# Altium schematic sheet 主控制器.SchDoc
size A3; Organization: Altium Limited; Address1: L3, 12a Rodborough Rd; Address2: Frenchs Forest; Address3: NSW; Address4: Australia 2086
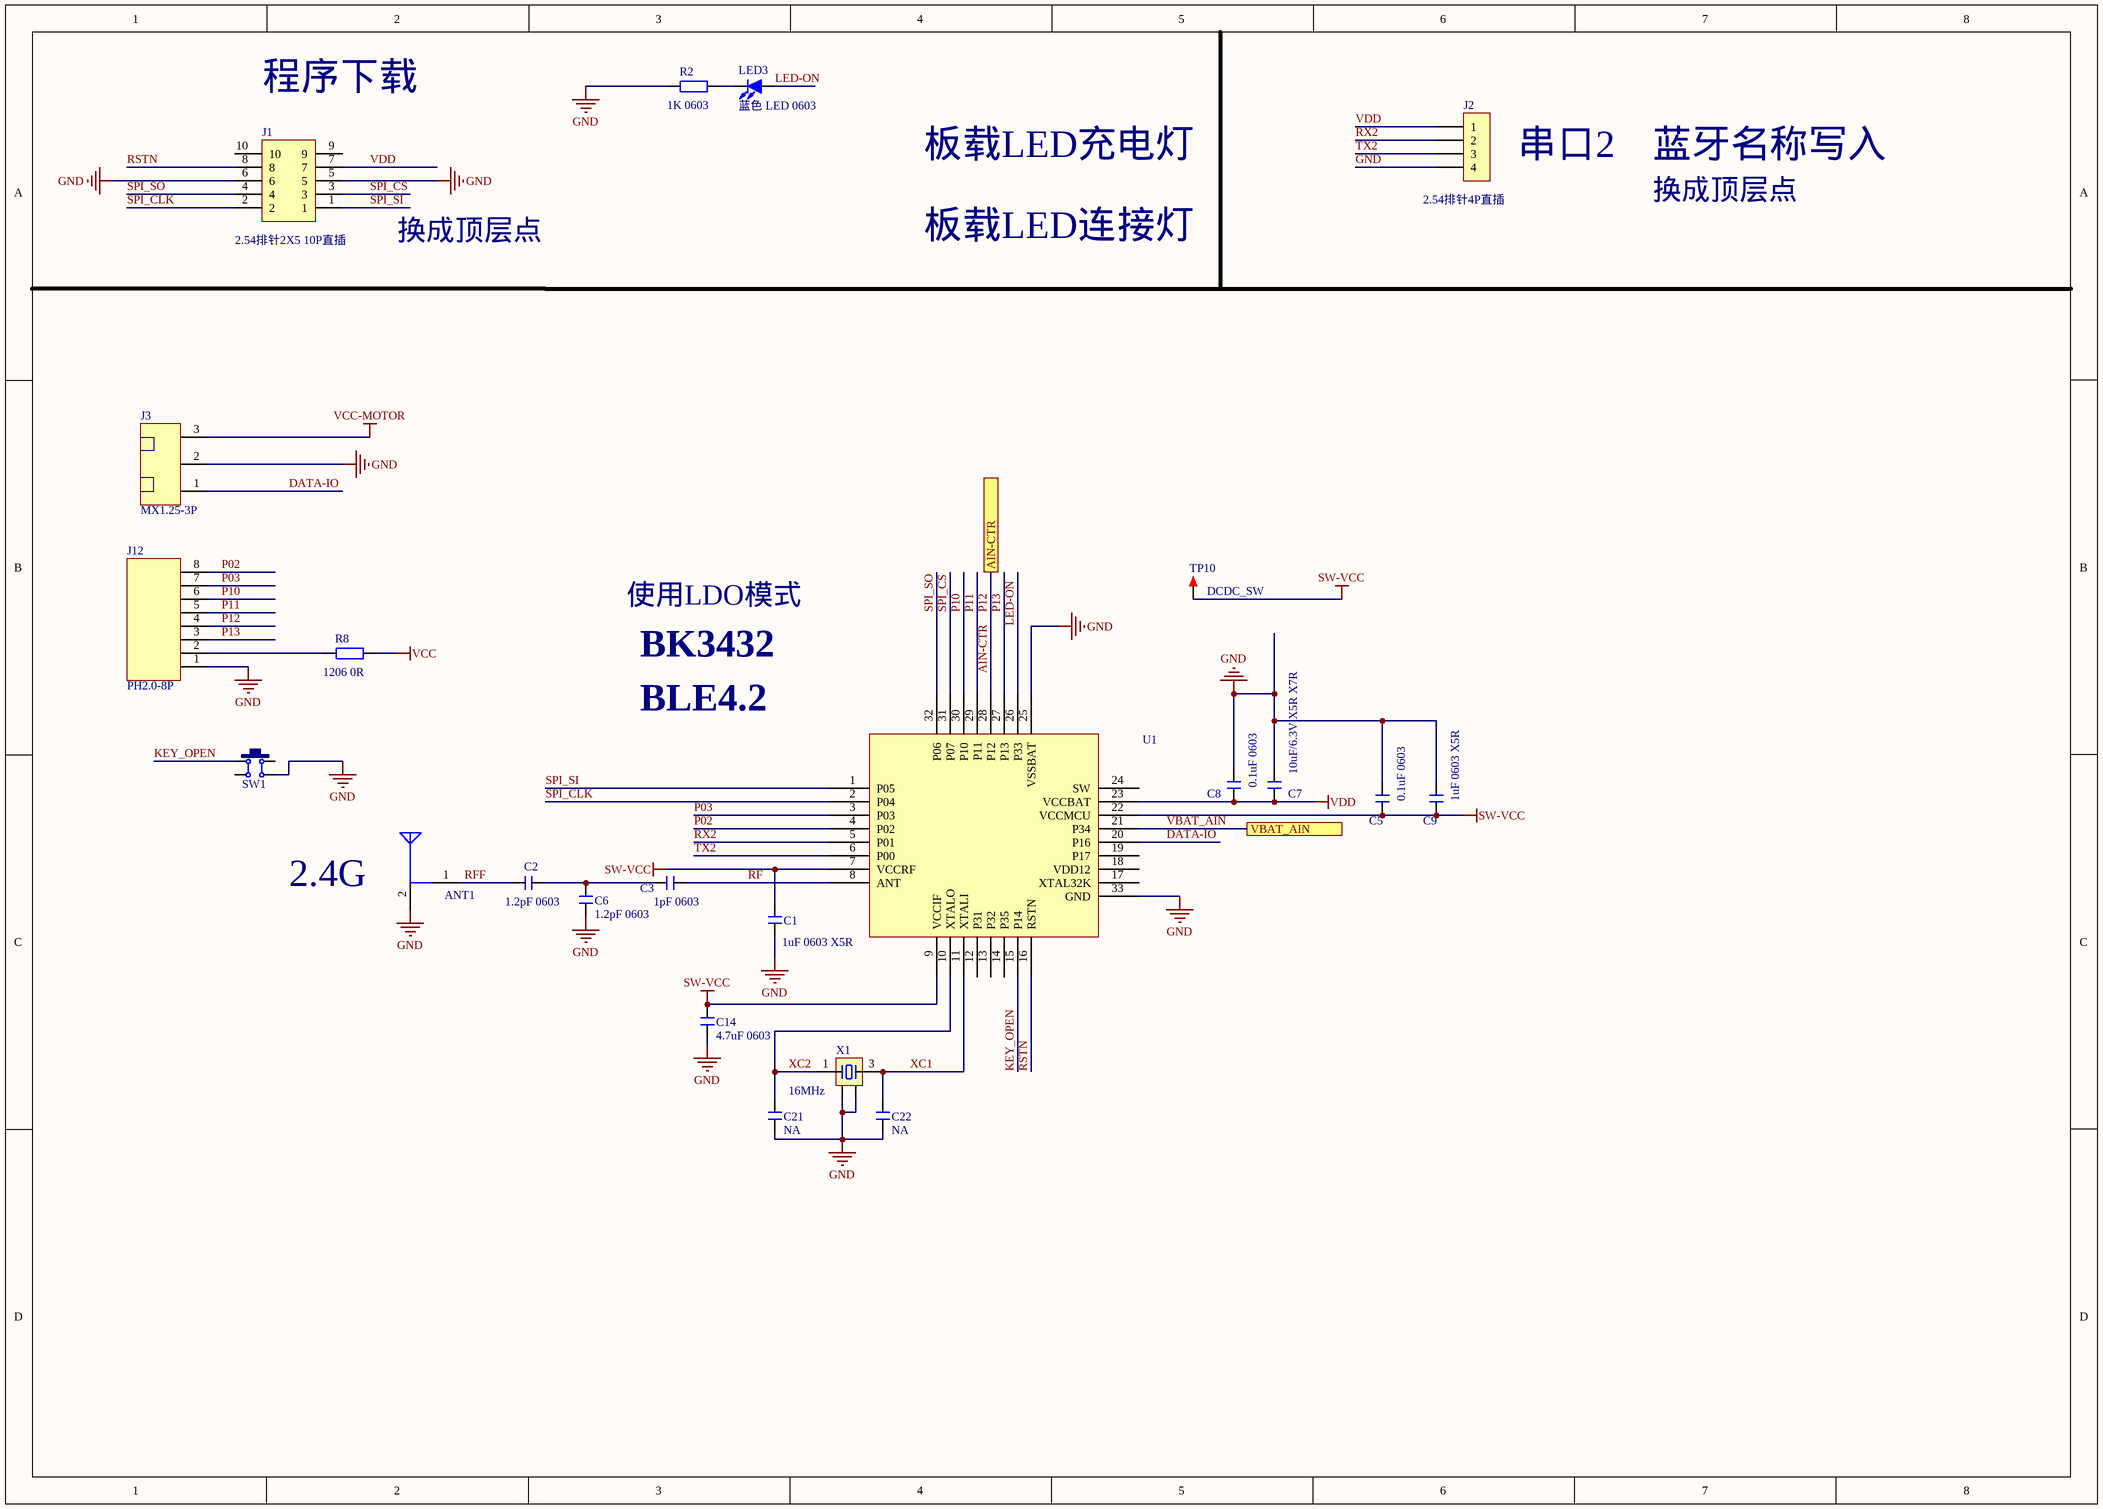
[diagram p0: 主控制器.SchDoc]

## Parts
ANT1  Board_RF  [BK3432-RF-2]  (value not drawn)
C1  1uF 0603 X5R  [C 0603]
C2  1.2pF 0603  [C 0603]
C3  1pF 0603  [C 0603]
C5  0.1uF 0603  [C 0603]
C6  1.2pF 0603  [C 0603]
C7  10uF/6.3V X5R X7R  [C 0603]
C8  0.1uF 0603  [C 0603]
C9  1uF 0603 X5R  [C 0603]
C14  4.7uF 0603  [C 0603]
C21  NA  [C 0603]
C22  NA  [C 0603]
J1  2.54排针2X5 10P直插  [Pin HDR2X5/2.54mm]
J2  2.54排针4P直插  [Pin HDR2.54MM/1X4]
J3  MX1.25-3P  [MX1.25S-3P]
J12  PH2.0-8P  [PH2.0-8P]
LED3  蓝色 LED 0603  [LED 0603G]
R2  1K 0603  [R 0603]
R8  1206 0R  [R 1206]
SW1  6x6x5  [TSW SMD-6*6*4.3]  (value not drawn)
TP10  DCDC_SW  [TEST 1]
U1  BK3432 QFN32  [QFN32]  (value not drawn)
X1  16MHz  [OSC 3225-4P]

## Ports
AIN-CTR, VBAT_AIN

## Nets
GND: C1.1 C5.1 C6.1 C7.1 C8.1 C9.1 C14.1 C21.1 C22.1 J1.5 J1.6 J2.4 J3.2 J12.1 R2.1 SW1.3 U1.25(VSSBAT) U1.33(GND) X1.2 X1.4
SW-VCC: C1.2 C5.2 C9.2 C14.2 TP10.1 U1.7(VCCRF) U1.9(VCCIF) U1.22(VCCMCU)
VCC: R8.2
VCC-MOTOR: J3.3
VDD: C7.2 C8.2 J1.7 J2.1 U1.23(VCCBAT)
AIN-CTR: J12.4 U1.28(P12) ; port AIN-CTR  [also labelled P12]
DATA-IO: J3.1 U1.20(P16)
KEY_OPEN: SW1.1 U1.15(P14)
LED-ON: LED3.1(A) U1.26(P33)
P02: J12.8 U1.4(P02)
P03: J12.7 U1.3(P03)
P10: J12.6 U1.30(P10)
P11: J12.5 U1.29(P11)
P13: J12.3 U1.27(P13)
RF: C3.2 U1.8(ANT)
RFF: ANT1.1(ANT) C2.1
RSTN: J1.8 U1.16(RSTN)
RX2: J2.2 U1.5(P01)
SPI_CLK: J1.2 U1.2(P04)
SPI_CS: J1.3 U1.31(P07)
SPI_SI: J1.1 U1.1(P05)
SPI_SO: J1.4 U1.32(P06)
TX2: J2.3 U1.6(P00)
VBAT_AIN: U1.21(P34) ; port VBAT_AIN
XC1: C22.2 U1.11(XTALI) X1.3
XC2: C21.2 U1.10(XTALO) X1.1
NetC2_2: C2.2 C3.1 C6.2
NetJ12_2: J12.2 R8.1
NetLED3_2: LED3.2(K) R2.2

Not connected (* = marked no-connect by the designer): ANT1 2(GND); J1 9 10; SW1 2 4; U1 12(P31) 13(P32) 14(P35) 17(XTAL32K) 18(VDD12) 19(P17) 24(SW)

## Notes on the sheet
- 程序下载
- 板载LED充电灯
- 串口2
- 蓝牙名称写入
- 换成顶层点
- 板载LED连接灯
- 使用LDO模式
- BK3432
- BLE4.2
- (near ANT1) 2.4G
- Labels drawn without touching a wire or pin: GND
- Title
- Size:
- Date:
- A3
- Number:
- Time:
- Revision:
- Sheet
- of
- File:

## Library data of the parts
ANT1 = SMA-2: SMA-板载2.4G射频天线; 版权归属: 源创客; BOM名称: 板载2.4G射频天线; 学习资源: www.ooocke.com
C1-C3 C5-C9 C14 C21 C22 = C: 无极性贴片电容; 版权归属: 源创客; BOM名称: 无极性贴片电容; 学习资源: www.ooocke.com
J1 = Pin HDR2X5
J2 = Pin HDR1X4
LED3 = LED-SMD: 贴片LED; 版权归属: 源创客; BOM名称: 贴片LED; 学习资源: www.ooocke.com
R2 R8 = R: 贴片电阻; 版权归属: 源创客; BOM名称: 贴片电阻; 学习资源: www.ooocke.com
SW1 = TSW SMD-6x6: 贴片6x6轻触开关; 版权归属: 源创客; BOM名称: 贴片6x6轻触开关; 学习资源: www.ooocke.com
TP10 = TEST TP: 测试环; 版权归属: 源创客; BOM名称: 测试环; 学习资源: www.ooocke.com
X1 = XTAL-4P: 4脚无源晶振